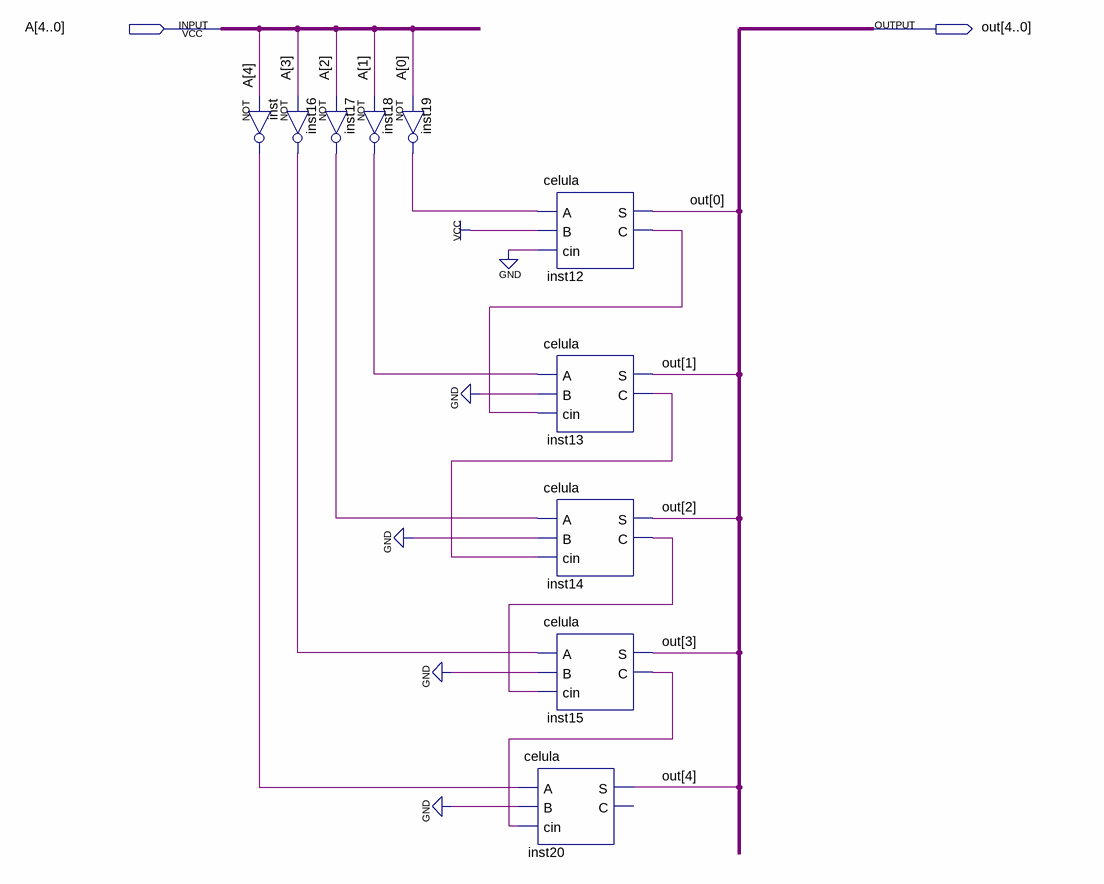
[diagram p0: schematic sheet]
// Quartus schematic Complemento2.bdf as structural Verilog: 10 symbols, 2 pins
module Complemento2 (
  input  [4:0] A,
  output [4:0] out
);

  wire inst12_c, inst13_c, inst14_c, inst15_c, inst16_out, inst17_out, inst18_out, inst19_out, inst_out;

  not inst (inst_out, A[4]);
  not inst16 (inst16_out, A[3]);
  not inst17 (inst17_out, A[2]);
  not inst18 (inst18_out, A[1]);
  not inst19 (inst19_out, A[0]);
  celula inst12 (.A(inst19_out), .B(1'b1), .cin(1'b0), .S(out[0]), .C(inst12_c));
  celula inst13 (.A(inst18_out), .B(1'b0), .cin(inst12_c), .S(out[1]), .C(inst13_c));
  celula inst14 (.A(inst17_out), .B(1'b0), .cin(inst13_c), .S(out[2]), .C(inst14_c));
  celula inst15 (.A(inst16_out), .B(1'b0), .cin(inst14_c), .S(out[3]), .C(inst15_c));
  celula inst20 (.A(inst_out), .B(1'b0), .cin(inst15_c), .S(out[4]));  // open: C
endmodule
